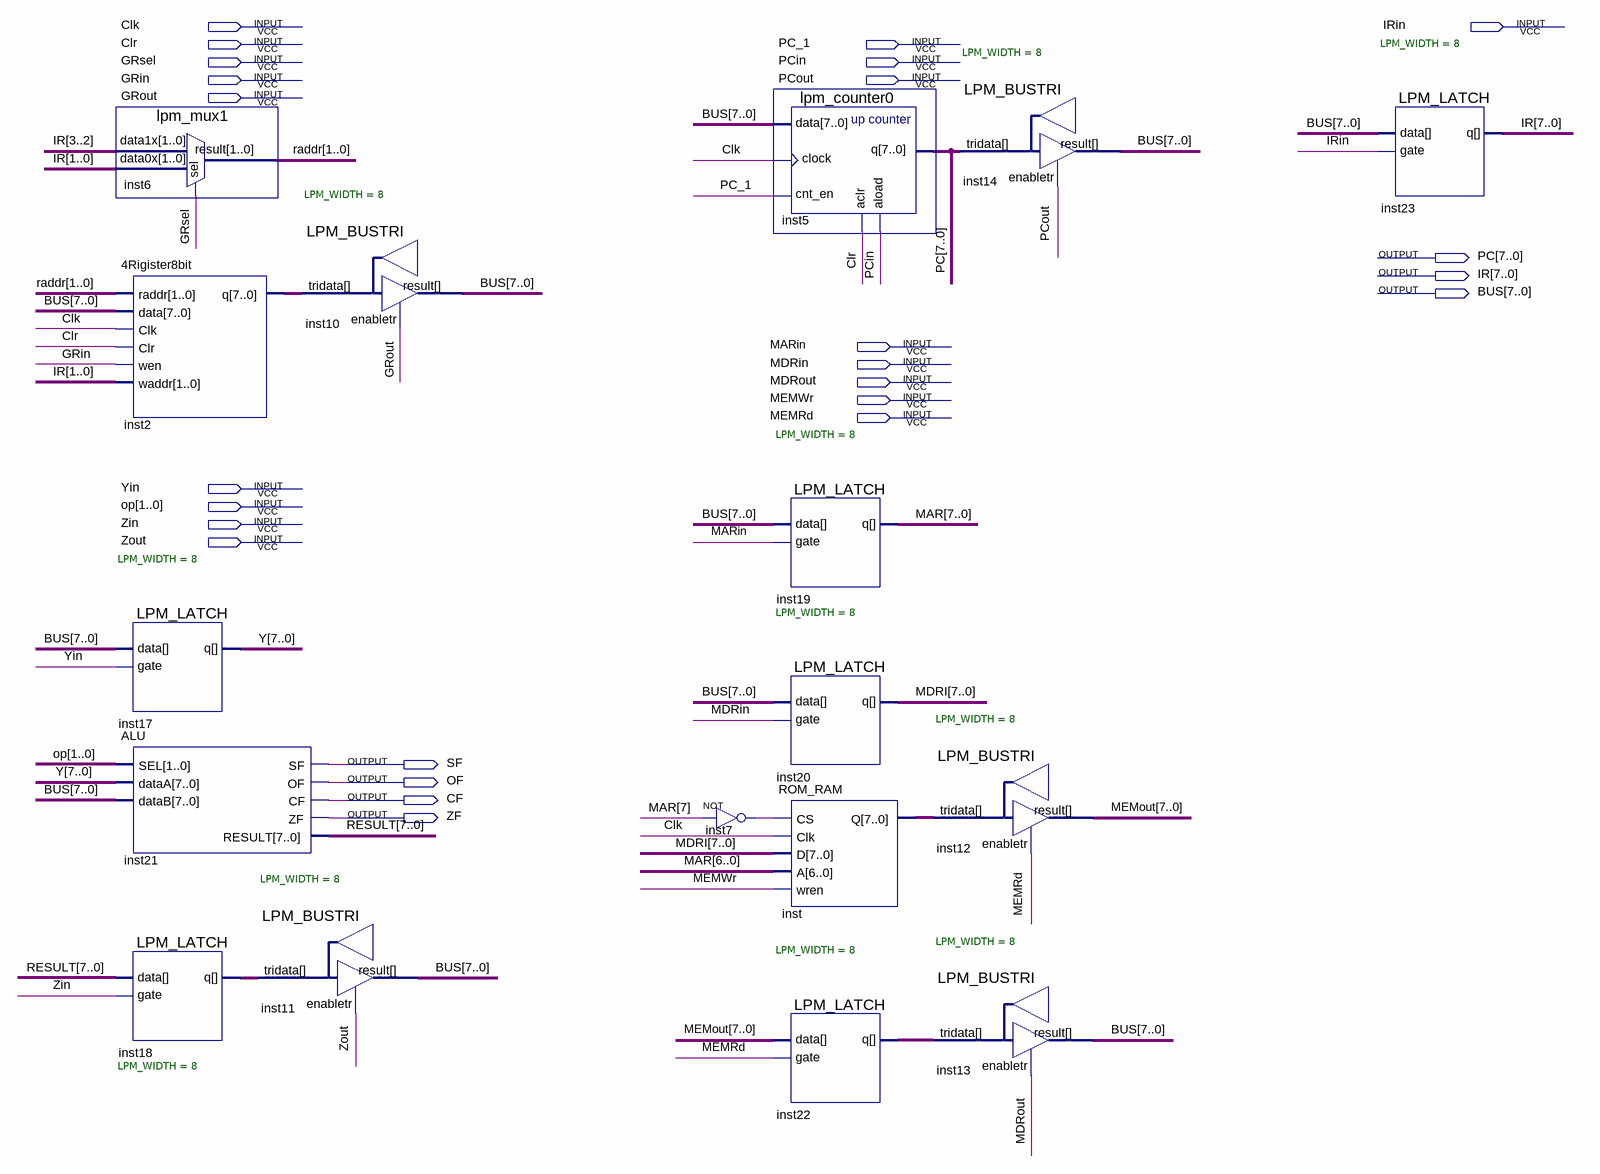
[diagram p0: schematic sheet]
// Quartus schematic EX_4.bdf as structural Verilog: 17 symbols, 25 pins
module EX_4 (
  input  Clk,
  input  IRin,
  input  Clr,
  input  PC_1,
  input  GRsel,
  input  PCin,
  input  GRin,
  input  PCout,
  input  GRout,
  input  MARin,
  input  MDRin,
  input  MDRout,
  input  MEMWr,
  input  MEMRd,
  input  Yin,
  input  [1:0] op,
  input  Zin,
  input  Zout,
  output [7:0] PC,
  output [7:0] IR,
  output [7:0] BUS,
  output SF,
  output OF,
  output CF,
  output ZF
);

  wire inst7_out;
  wire [1:0] raddr;
  wire [7:0] inst2_q, inst18_q, inst22_q, inst_q, MAR, MDRI, MEMout, RESULT, Y;

  lpm_mux1 inst6 (.data1x(IR[3:2]), .data0x(IR[1:0]), .sel(GRsel), .result(raddr));
  \4Rigister8bit  inst2 (.raddr(raddr), .data(BUS), .Clk(Clk), .Clr(Clr), .wen(GRin), .waddr(IR[1:0]), .q(inst2_q));
  LPM_LATCH #(.LPM_WIDTH(8)) inst17 (.data(BUS), .gate(Yin), .q(Y));
  ALU inst21 (.SEL(op), .dataA(Y), .dataB(BUS), .SF(SF), .OF(OF), .CF(CF), .ZF(ZF), .RESULT(RESULT));
  LPM_LATCH #(.LPM_WIDTH(8)) inst18 (.data(RESULT), .gate(Zin), .q(inst18_q));
  LPM_BUSTRI #(.LPM_WIDTH(8)) inst11 (.enabletr(Zout), .result(BUS), .tridata(inst18_q));
  LPM_BUSTRI #(.LPM_WIDTH(8)) inst10 (.enabletr(GRout), .result(BUS), .tridata(inst2_q));
  not inst7 (inst7_out, MAR[7]);
  lpm_counter0 inst5 (.data(BUS), .clock(Clk), .cnt_en(PC_1), .aclr(Clr), .aload(PCin), .q(PC));
  LPM_LATCH #(.LPM_WIDTH(8)) inst19 (.data(BUS), .gate(MARin), .q(MAR));
  LPM_LATCH #(.LPM_WIDTH(8)) inst20 (.data(BUS), .gate(MDRin), .q(MDRI));
  ROM_RAM inst (.CS(inst7_out), .Clk(Clk), .D(MDRI), .A(MAR[6:0]), .wren(MEMWr), .Q(inst_q));
  LPM_LATCH #(.LPM_WIDTH(8)) inst22 (.data(MEMout), .gate(MEMRd), .q(inst22_q));
  LPM_BUSTRI #(.LPM_WIDTH(8)) inst14 (.enabletr(PCout), .result(BUS), .tridata(PC));
  LPM_BUSTRI #(.LPM_WIDTH(8)) inst12 (.enabletr(MEMRd), .result(MEMout), .tridata(inst_q));
  LPM_BUSTRI #(.LPM_WIDTH(8)) inst13 (.enabletr(MDRout), .result(BUS), .tridata(inst22_q));
  LPM_LATCH #(.LPM_WIDTH(8)) inst23 (.data(BUS), .gate(IRin), .q(IR));
endmodule
